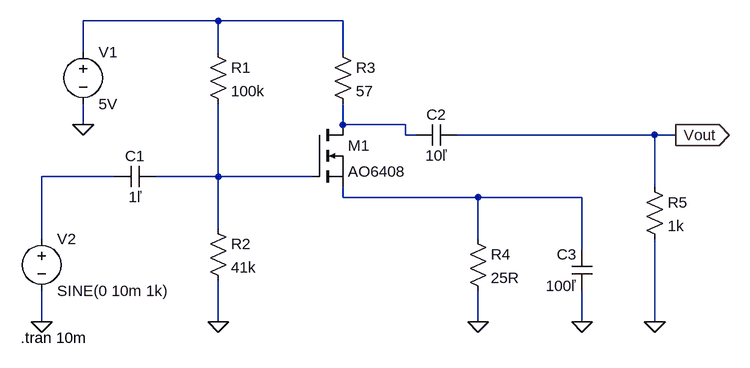
[diagram p0: schematic NNM24EE010_AnanyaSPoojary.asc]
NNM24EE010_AnanyaSPoojary.asc, the LTspice schematic file:
Version 4.1
SHEET 1 880 680
WIRE 16 -80 -192 -80
WIRE 208 -80 16 -80
WIRE -192 -32 -192 -80
WIRE 16 -32 16 -80
WIRE 208 -32 208 -80
WIRE -192 80 -192 48
WIRE 208 80 208 48
WIRE 304 80 208 80
WIRE 304 96 304 80
WIRE 320 96 304 96
WIRE 688 96 384 96
WIRE 720 96 688 96
WIRE -144 160 -256 160
WIRE 16 160 16 48
WIRE 16 160 -80 160
WIRE 160 160 16 160
WIRE 688 176 688 96
WIRE 208 192 208 176
WIRE 416 192 208 192
WIRE 576 192 416 192
WIRE 16 240 16 160
WIRE -256 256 -256 160
WIRE 416 256 416 192
WIRE 576 272 576 192
WIRE -256 384 -256 336
WIRE 16 384 16 320
WIRE 416 384 416 336
WIRE 576 384 576 336
WIRE 688 384 688 256
FLAG -256 384 0
FLAG 16 384 0
FLAG 416 384 0
FLAG 576 384 0
FLAG 688 384 0
FLAG -192 80 0
FLAG 720 96 Vout
IOPIN 720 96 Out
SYMBOL nmos 160 80 R0
SYMATTR InstName M1
SYMATTR Value AO6408
SYMBOL res 0 -48 R0
SYMATTR InstName R1
SYMATTR Value 100k
SYMBOL res 0 224 R0
SYMATTR InstName R2
SYMATTR Value 41k
SYMBOL res 192 -48 R0
SYMATTR InstName R3
SYMATTR Value 57
SYMBOL res 400 240 R0
SYMATTR InstName R4
SYMATTR Value 25R
SYMBOL res 672 160 R0
SYMATTR InstName R5
SYMATTR Value 1k
SYMBOL voltage -192 -48 R0
SYMATTR InstName V1
SYMATTR Value 5V
SYMBOL voltage -256 240 R0
WINDOW 123 0 0 Left 0
WINDOW 39 0 0 Left 0
SYMATTR InstName V2
SYMATTR Value SINE(0 10m 1k)
SYMBOL cap -80 144 R90
WINDOW 0 0 32 VBottom 2
WINDOW 3 32 32 VTop 2
SYMATTR InstName C1
SYMATTR Value 1ľ
SYMBOL cap 384 80 R90
WINDOW 0 0 32 VBottom 2
WINDOW 3 32 32 VTop 2
SYMATTR InstName C2
SYMATTR Value 10ľ
SYMBOL cap 592 336 R180
WINDOW 0 24 56 Left 2
WINDOW 3 24 8 Left 2
SYMATTR InstName C3
SYMATTR Value 100ľ
TEXT -288 408 Left 2 !.tran 10m

The netlist it stands for:
* NNM24EE010_AnanyaSPoojary.asc
M1 N002 N004 N005 N005 AO6408
R1 N001 N004 100k
R2 N004 0 41k
R3 N001 N002 57
R4 N005 0 25R
R5 Vout 0 1k
V1 N001 0 5V
V2 N003 0 SINE(0 10m 1k)
C1 N004 N003 1ľ
C2 Vout N002 10ľ
C3 0 N005 100ľ
.model NMOS NMOS
.model PMOS PMOS
.lib standard.mos
.tran 10m
.backanno
.end